# EAGLE design DigiPot breakout (EAGLE 8.5.0)
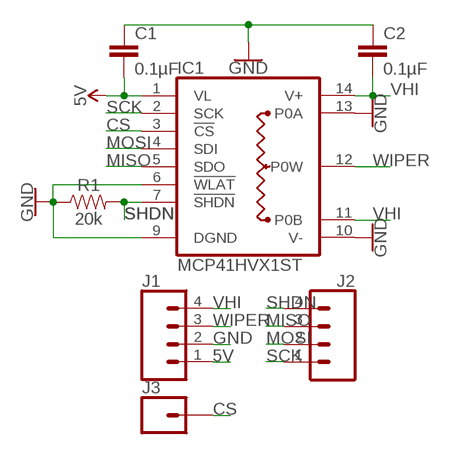
[diagram p0: schematic, sheet 1]

## Parts
C1  0.1µF  0.1µF-0.1''  [CAP-0.1I]
C2  0.1µF  0.1µF-0.1''  [CAP-0.1I]
IC1  MCP41HVX1ST  [TSSOP14]
J1  CONN_04  [1X04]
J2  CONN_04  [1X04]
J3  CONN_01  [1X01]
R1  20k  1KOHM-HORIZ-1/4W-5%  [AXIAL-0.3]

## Nets
5V: C1.2 IC1.1(VL) J1.1
CS: IC1.3(!CS) J3.1
GND: C1.1 C2.1 IC1.6(!WLAT) IC1.9(DGND) IC1.10(V-) IC1.13(P0A) J1.2 R1.P$1
MISO: IC1.5(SDO) J2.3
MOSI: IC1.4(SDI) J2.2
SCK: IC1.2(SCK) J2.1
SHDN: IC1.7(!SHDN) J2.4 R1.P$2
VHI: C2.2 IC1.11(P0B) IC1.14(V+) J1.4
WIPER: IC1.12(P0W) J1.3

## Library data of the parts
C1 C2 = Clock components:0.1µF: 0.1uF/100nF/100,000pF ceramic capacitors A capacitor is a passive two-terminal electrical component used to store electrical energy temporarily in an electric field.
IC1 = microchip-mcp41hvx1:MCP41HVX1: The MCP45HVX1 family of devices have dual power rails (analog and digital). The analog power rail allows high voltage on the resistor network terminal pins. The analog voltage range is determined by the V+ and V– voltages. The library has been designed by Richard Magdycz <https://www.facebook.com/groups/eaglecadsoftUK>
J1 J2 = SparkFun-Connectors:CONN_04: Multi connection point. Often used as Generic Header-pin footprint for 0.1 inch spaced/style header connections On any of the 0.1 inch spaced packages, you can populate with these: Break Away Headers - Straight <https://www.sparkfun.com/products/116> (PRT-00116) Break Away Male Headers - Right Angle <https://www.sparkfun.com/products/553> (PRT-00553) Female Headers <https://www.sparkfun.com/products/115> (PRT-00115) Break Away Headers - Machine Pin <https://www.sparkfun.com/products/117> (PRT-00117) Break Away Female Headers - Swiss Machine Pin <https://www.sparkfun.com/products/743> (PRT-00743) For SCREWTERMINALS and SPRING TERMINALS visit here: Screw Terimnals on SparkFun.com <https://www.sparkfun.com/search/results?term=Screw+Terminals> (5mm/3.5mm/2.54mm spacing) This device is also useful as a general connection point to wire up your design to another part of your project. Our various solder wires solder well into these plated through hole pads. Hook-Up Wire - Assortment (Stranded, 22 AWG) <https://www.sparkfun.com/products/11375> (PRT-11375) Hook-Up Wire - Assortment (Solid Core, 22 AWG) <https://www.sparkfun.com/products/11367> (PRT-11367) View the entire wire category on our website here <https://www.sparkfun.com/categories/141> Special notes: Molex polarized connector foot print use with SKU : PRT-08231 with associated crimp pins and housings. 1MM SMD Version SKU: PRT-10208; PROD_ID: CONN-09696
J3 = SparkFun-Connectors:CONN_01: Single connection point. Often used as Generic Header-pin footprint for 0.1 inch spaced/style header connections On any of the 0.1 inch spaced packages, you can populate with these: Break Away Headers - Straight <https://www.sparkfun.com/products/116> (PRT-00116) Break Away Male Headers - Right Angle <https://www.sparkfun.com/products/553> (PRT-00553) Female Headers <https://www.sparkfun.com/products/115> (PRT-00115) Break Away Headers - Machine Pin <https://www.sparkfun.com/products/117> (PRT-00117) Break Away Female Headers - Swiss Machine Pin <https://www.sparkfun.com/products/743> (PRT-00743) This device is also useful as a general connection point to wire up your design to another part of your project. Our various solder wires solder well into these plated through hole pads. Hook-Up Wire - Assortment (Stranded, 22 AWG) <https://www.sparkfun.com/products/11375> (PRT-11375) Hook-Up Wire - Assortment (Solid Core, 22 AWG) <https://www.sparkfun.com/products/11367> (PRT-11367) View the entire wire category on our website here <https://www.sparkfun.com/categories/141> Special notes: SMTSO-256-ET is a "flush mount" nut for a 4-40 screw. We mostly use this on specialty testbeds; it is a nice way to connect hardware to your PCB at an adjustable hieght. Also note, the SNAP packages are for using a snappable style connector. We sell a baggie of snaps and they are also used on two LilyPad designs: Snap Assortment - 30 pack (male and female) <https://www.sparkfun.com/products/11347> (DEV-11347) LilyPad Arduino SimpleSnap <https://www.sparkfun.com/products/10941> (DEV-10941) LilyPad SimpleSnap Protoboard <https://www.sparkfun.com/products/10940> (DEV-10940)
R1 = SparkFun-Resistors:1KOHM: 1kΩ resistor A resistor is a passive two-terminal electrical component that implements electrical resistance as a circuit element. Resistors act to reduce current flow, and, at the same time, act to lower voltage levels within circuits. - Wikipedia; PROD_ID: RES-08380; VALUE: 1k

## Board
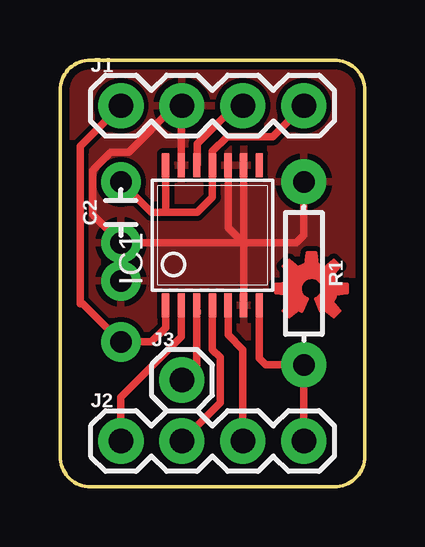
[diagram p1: board, top side]
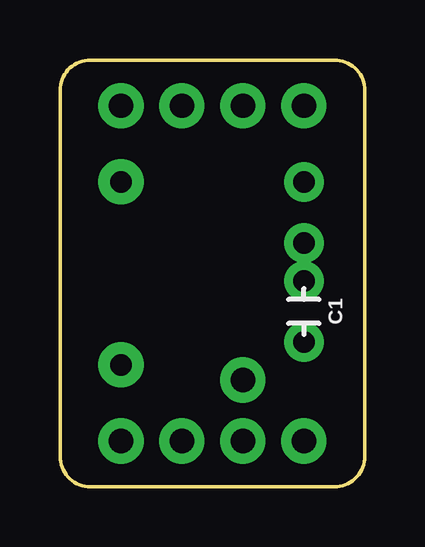
[diagram p2: board, bottom side, seen from below]

Size 12.7 x 17.78 mm. Coordinates in mm from the lower left corner, seen from the top.
Outline: 12.7,16.51 12.7,1.27 arc-90 11.43,0 1.27,0 arc-90 0,1.27 0,16.51 arc-90 1.27,17.78 11.43,17.78 arc-90 12.7,16.51
Copper layers (1*16): Top 0.035mm / dielectric 1.5mm / Bottom 0.035mm
Design rules "default *": minimum track width 12mil, minimum drill 0.35mm, track to track 8mil, track to pad 8mil, pad to pad 8mil, via to via 8mil, smd to smd 8mil, copper to edge 12mil, drill to drill 8mil, minimum pad ring 10mil, minimum via ring 8mil, stop-mask expansion 4mil, vias tented up to drill 0mil, thermal gap 10mil

### Footprints (pad centres in the part's own frame; a part is rotated, then mirrored left to right if it is on the bottom)
CAP-0.1I = drill 0.9 pad 1.651: 1 -1.27,0; 2 1.27,0
TSSOP14 = smd 0.305 x 0.991: 1 -1.95,-2.918; 2 -1.3,-2.918; 3 -0.65,-2.918; 4 0,-2.918; 5 0.65,-2.918; 6 1.3,-2.918; 7 1.95,-2.918; 8 1.95,2.918; 9 1.3,2.918; 10 0.65,2.918; 11 0,2.918; 12 -0.65,2.918; 13 -1.3,2.918; 14 -1.95,2.918
1X04 = drill 1.016 pad 1.88: 1 0,0; 2 2.54,0; 3 5.08,0; 4 7.62,0
1X01 = drill 1.016 pad 1.88: 1 0,0
AXIAL-0.3 = drill 0.9 pad 1.88: P$1 -3.81,0; P$2 3.81,0

### Placement (x,y rotation side)
C1  2.54,7.3 270 bottom
C2  2.54,11.43 90 top
IC1  6.35,10.48 0 top
J1  2.54,15.88 0 top
J2  2.54,1.91 0 top
J3  5.08,4.45 0 top
R1  10.16,8.89 270 top
U$1  [OSHW-LOGO-S_COPPER]  10.48,8.26 0 top

### Tracks (layer width: path | path; a pad name or v marks a point on that pad's centre or on a via)
5V
  Top 0.305: IC1.1 4.4,6.62 3.81,6.03 C1.2 0.95,7.62 0.85,7.62 0.85,13.97 0.85,14.19 J1.1
CS
  Top 0.305: 5.71,7.23 IC1.3 5.7,5.07 J3.1
GND
  Top 0.305: 7.65,7.27 IC1.6 7.65,10.18 | IC1.9 7.65,10.18 | 7.65,10.18 7.63,10.16 | R1.P$1 10.16,10.48 9.84,10.16 7.63,10.16 | IC1.13 5.05,15.21 J1.2 4.79,15.88 2.86,13.95 2.11,13.95 1.36,13.19 1.36,11.34 C2.1 | C2.1 C1.1 | C2.1 7.63,10.16 | IC1.10 7,10.79 7.63,10.16
  pour Top: -0.32,18.41 13.65,18.41 13.65,-0.95 -1.27,-0.95 -1.27,17.46
MISO
  Top 0.305: J2.3 7.62,5.71 7,6.33 IC1.5
MOSI
  Top 0.305: IC1.4 6.35,5.71 6.67,5.4 6.67,3.49 J2.2
SCK
  Top 0.305: 2.54,3.17 J2.1 2.54,3.74 5.05,6.25 IC1.2
SHDN
  Top 0.305: IC1.7 8.3,5.35 8.57,5.08 R1.P$2 J2.4
VHI
  Top 0.305: J1.4 8.87,14.58 6.96,14.58 6.35,13.97 IC1.11 6.35,12.06 5.71,11.43 4.45,11.43 | C2.2 3.81,11.43 4.45,11.43 | IC1.14 4.4,11.47 4.45,11.43
WIPER
  Top 0.305: IC1.12 5.71,13.41 5.71,14.29 7.3,15.88 J1.3